# EAGLE design PCB_servicio (EAGLE 9.6.2)
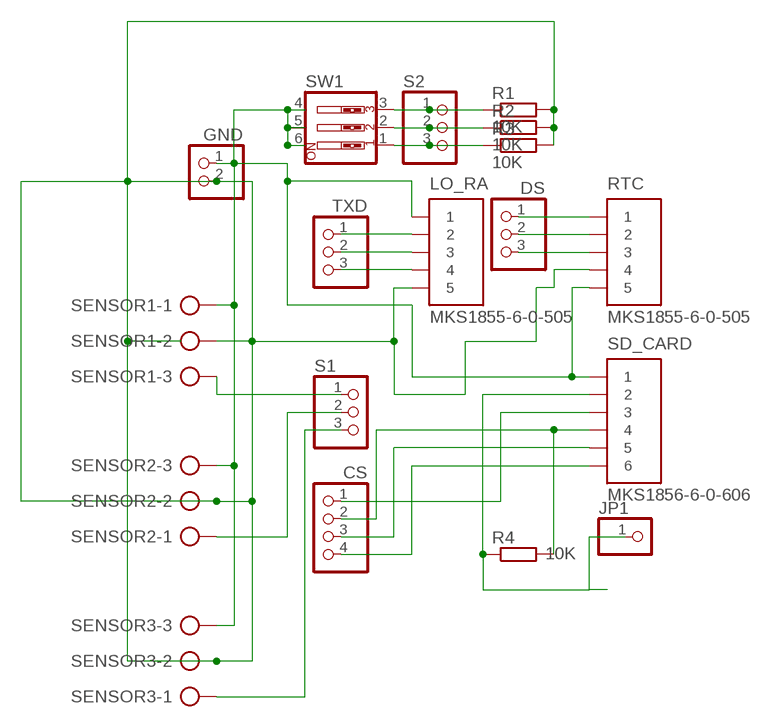
[diagram p0: schematic, sheet 1]

## Parts
CS  PINHD-1X4  [1X04]
DS  PINHD-1X3  [1X03]
GND  PINHD-1X2  [1X02]
JP1  PINHD-1X1  [1X01]
LO_RA  MKS1855-6-0-505  [MKS1855-6-0-505]
R1  10K  R-EU_0207/12  [0207/12]
R2  10K  R-EU_0207/12  [0207/12]
R3  10K  R-EU_0207/12  [0207/12]
R4  10K  R-EU_0207/12  [0207/12]
RTC  MKS1855-6-0-505  [MKS1855-6-0-505]
S1  PINHD-1X3  [1X03]
S2  PINHD-1X3  [1X03]
SD_CARD  MKS1856-6-0-606  [MKS1856-6-0-606]
SENSOR1  AK500/3  [AK500/3]
SENSOR2  AK500/3  [AK500/3]
SENSOR3  AK500/3  [AK500/3]
SW1  SW_DIP-3  [EDG-03]
TXD  PINHD-1X3  [1X03]

## Nets
N$1: GND.1 LO_RA.1 RTC.5 SD_CARD.1 SENSOR1.1 SENSOR2.3 SENSOR3.3 SW1.4 SW1.5 SW1.6
N$2: GND.2 LO_RA.5 R1.2 R2.2 R3.2 RTC.4 SENSOR1.2 SENSOR2.2 SENSOR3.2
N$3: S1.1 SENSOR1.3
N$4: S1.2 SENSOR2.1
N$5: S1.3 SENSOR3.1
N$6: R1.1 S2.1 SW1.3
N$7: R2.1 S2.2 SW1.2
N$8: R3.1 S2.3 SW1.1
N$9: LO_RA.2 TXD.1
N$10: LO_RA.3 TXD.2
N$11: LO_RA.4 TXD.3
N$12: CS.3 SD_CARD.5
N$13: CS.4 SD_CARD.6
N$14: CS.2 R4.2 SD_CARD.4
N$15: CS.1 SD_CARD.3
N$16: JP1.1 R4.1 SD_CARD.2
N$20: DS.1 RTC.1
N$21: DS.2 RTC.2
N$22: DS.3 RTC.3

## Library data of the parts
CS = pinhead:PINHD-1X4: PIN HEADER
DS S1 S2 TXD = pinhead:PINHD-1X3: PIN HEADER
GND = pinhead:PINHD-1X2: PIN HEADER
JP1 = pinhead:PINHD-1X1: PIN HEADER
LO_RA RTC = con-stocko:MKS1855-6-0-505: Serie MKS 1850 Lötstifte In-line, Raster 2.5 mm, Stiftwannen, stehend, mit Rastlasche Source: http://www.stocko.de/de/index.php?seite=ka_rfk2_mks1850.html&rubrik=Katalog+-+RFK+2 rfk_1850.pdf; OC_FARNELL: 1134508; OC_NEWARK: unknown
R1-R4 = rcl:R-EU_: RESISTOR, European symbol; SPICEPREFIX: R
SD_CARD = con-stocko:MKS1856-6-0-606: Serie MKS 1850 Lötstifte In-line, Raster 2.5 mm, Stiftwannen, stehend, mit Rastlasche Source: http://www.stocko.de/de/index.php?seite=ka_rfk2_mks1850.html&rubrik=Katalog+-+RFK+2 rfk_1850.pdf; OC_FARNELL: 1174959; OC_NEWARK: unknown
SENSOR1-SENSOR3 = con-ptr500:AK500/3: CONNECTOR; OC_FARNELL: unknown; OC_NEWARK: unknown
SW1 = special:SW_DIP-3: DIP SWITCH

## Board
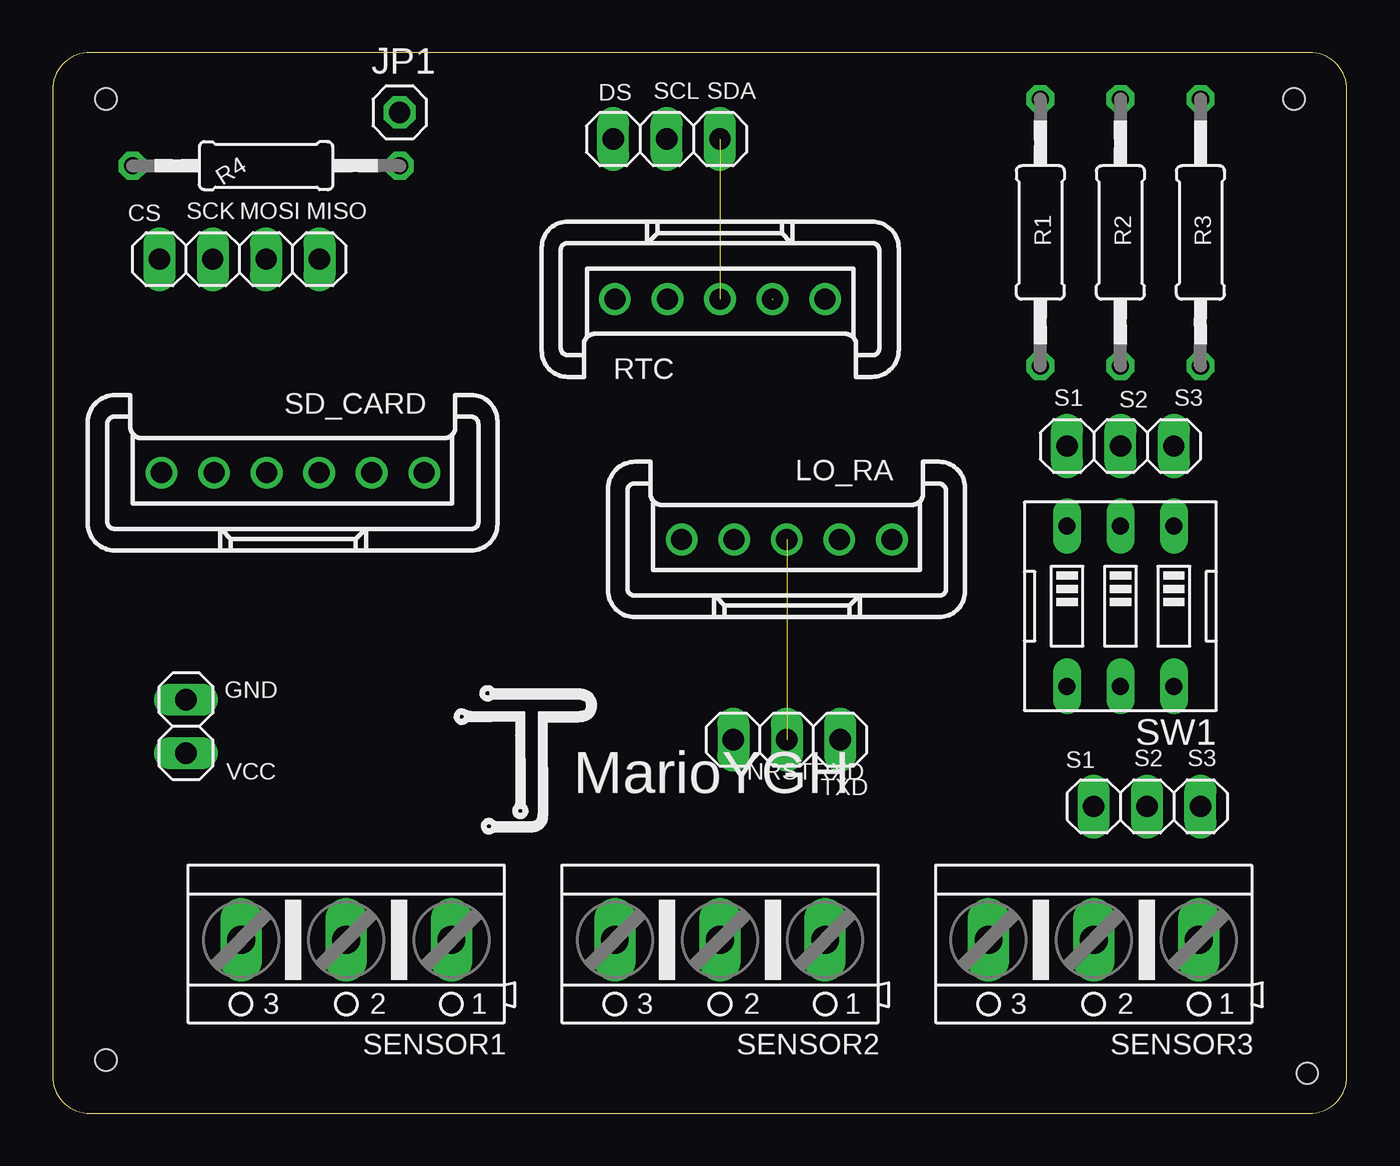
[diagram p1: board, top side]
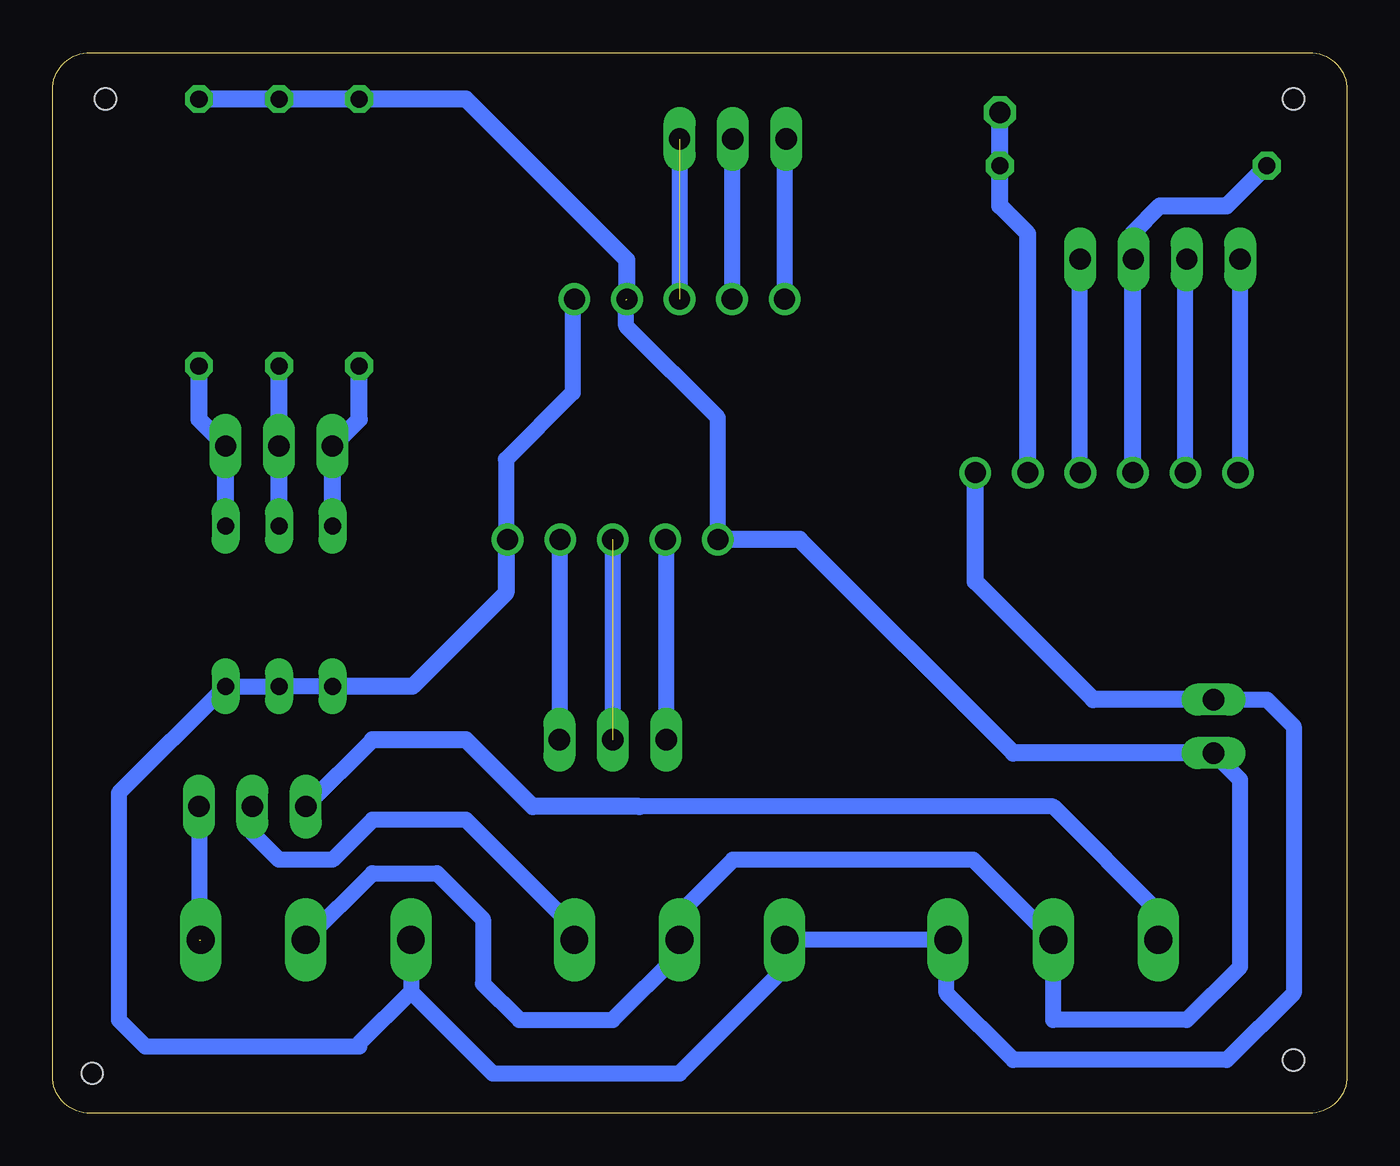
[diagram p2: board, bottom side, seen from below]

Size 61.57 x 50.47 mm. Coordinates in mm from the lower left corner, seen from the top.
Outline: 0,48.69 0,1.78 arc90 1.78,0 59.8,0 arc90 61.57,1.78 61.57,48.69 arc90 59.8,50.47 1.78,50.47 arc90 0,48.69
Copper layers (1*16): Top 0.035mm / dielectric 1.5mm / Bottom 0.035mm
Design rules "default": minimum track width 6mil, minimum drill 0.35mm, track to track 6mil, track to pad 6mil, pad to pad 6mil, via to via 6mil, smd to smd 6mil, copper to edge 40mil, drill to drill 6mil, minimum pad ring 10mil, minimum via ring 8mil, stop-mask expansion 4mil, vias tented up to drill 0mil, thermal gap 10mil
Holes 1 mm at 59.05,48.26 59.69,1.91 2.54,2.54 2.54,48.26

### Footprints (pad centres in the part's own frame; a part is rotated, then mirrored left to right if it is on the bottom)
1X04 = drill 1.016 long: 1 -3.81,0; 2 -1.27,0; 3 1.27,0; 4 3.81,0
1X03 = drill 1.016 long: 1 -2.54,0; 2 0,0; 3 2.54,0
1X02 = drill 1.016 long: 1 -1.27,0; 2 1.27,0
1X01 = drill 1.016 octagon: 1 0,0
MKS1855-6-0-505 = drill 1 pad 1.422: 1 -5,0; 2 -2.5,0; 3 0,0; 4 2.5,0; 5 5,0
0207/12 = drill 0.813 octagon: 1 -6.35,0; 2 6.35,0
MKS1856-6-0-606 = drill 1 pad 1.422: 1 -6.25,0; 2 -3.75,0; 3 -1.25,0; 4 1.25,0; 5 3.75,0; 6 6.25,0
AK500/3 = drill 1.321 long: 1 -5.004,0; 2 0,0; 3 5.004,0
EDG-03 = drill 0.813 long: 1 -2.54,-3.81; 2 0,-3.81; 3 2.54,-3.81; 4 2.54,3.81; 5 0,3.81; 6 -2.54,3.81

### Placement (x,y rotation side)
CS  8.89,40.64 180 top
DS  29.21,46.36 0 top
GND  6.35,18.41 270 top
JP1  16.51,47.62 0 top
LO_RA  34.93,27.31 180 top
R1  46.99,41.91 90 top
R2  50.8,41.91 90 top
R3  54.61,41.91 90 top
R4  10.16,45.08 180 top
RTC  31.75,38.73 0 top
S1  52.07,14.61 0 top
S2  50.8,31.75 0 top
SD_CARD  11.43,30.48 180 top
SENSOR1  13.97,8.26 180 top
SENSOR2  31.75,8.26 180 top
SENSOR3  49.53,8.26 180 top
SW1  50.8,24.13 180 top
TXD  34.93,17.78 180 top

### Tracks (layer width: path | path; a pad name or v marks a point on that pad's centre or on a via)
N$1
  Bottom 0.762: SENSOR3.3 44.53,5.79 | 44.53,5.79 40.64,1.91 31.75,1.91 26.75,6.91 SENSOR2.3 19.05,8.26 | SENSOR1.1 19.05,8.26 | GND.1 3.81,19.68 2.54,18.41 2.54,5.71 5.71,2.54 15.87,2.54 19.05,5.71 19.05,8.26 | 44.53,5.79 46.99,3.33 46.99,3.18 57.15,3.18 58.42,4.45 58.42,15.24 SW1.6 SW1.5 SW1.4 | RTC.5 36.83,38.66 36.83,34.29 40.01,31.11 40.01,27.22
  Bottom 0.813: GND.1 12.07,19.68 17.68,25.3 SD_CARD.1 | LO_RA.1 40.01,27.22 40.01,24.77 44.45,20.32 SW1.4
N$2  (1 unrouted)
  Bottom 0.762: SENSOR3.2 46.35,11.43 43.29,11.43 41.1,9.24 41.1,6.17 39.37,4.45 34.93,4.45 31.75,7.62 SENSOR2.2 31.75,9.53 29.21,12.07 17.78,12.07 SENSOR1.2 13.97,4.45 7.62,4.45 5.08,6.98 5.08,15.88 GND.2 | LO_RA.5 29.93,33.1 34.29,37.47 34.29,38.69
  Bottom 0.813: R3.2 R2.2 R1.2 41.91,48.26 34.25,40.6 RTC.4 | LO_RA.5 26.04,27.31 15.87,17.14 GND.2
N$3
  Bottom 0.762: 33.65,14.61 13.97,14.61 8.89,9.53 8.89,8.33 SENSOR1.3 | 46.35,17.78 S1.1
  Bottom 0.813: 33.65,14.61 38.73,14.61 41.91,17.78 46.35,17.78
N$4
  Bottom 0.762: S1.2 52.07,13.34 50.8,12.07 48.26,12.07 46.35,13.97 41.91,13.97 36.75,8.81 SENSOR2.1
N$5  (1 unrouted)
  Bottom 0.762: S1.3 54.61,8.26
N$6
  Bottom 0.813: SW1.3 S2.1 46.99,33.02 R1.1
N$7
  Bottom 0.813: SW1.2 S2.2 R2.1
N$8
  Bottom 0.813: SW1.1 S2.3 54.61,33.02 R3.1
N$9
  Bottom 0.762: TXD.1 37.43,17.82 LO_RA.2
N$10  (1 unrouted)
  Bottom 0.762: LO_RA.3 TXD.2
N$11
  Bottom 0.762: TXD.3 32.38,27.26 LO_RA.4
N$12
  Bottom 0.762: SD_CARD.5 7.68,40.58 CS.3
N$13
  Bottom 0.762: SD_CARD.6 5.08,30.58 CS.4
N$14
  Bottom 0.813: SD_CARD.4 10.18,40.62 CS.2 10.16,41.91 8.89,43.18 5.71,43.18 R4.2
N$15
  Bottom 0.762: SD_CARD.3 12.7,30.5 CS.1
N$16
  Bottom 0.813: JP1.1 R4.1 16.51,43.18 15.18,41.85 SD_CARD.2
N$20
  Bottom 0.762: DS.1 26.75,46.28 RTC.1
N$21
  Bottom 0.762: DS.2 29.25,46.31 RTC.2
N$22  (2 unrouted)
  Bottom 0.762: DS.3 RTC.3

### Text on the board
tPlace: SCL | SDA | SCK | MOSI | MISO | S1 | S3 | VCC | NRST | RXD | S2 | S3 | MarioYGH